# EAGLE design HighPowerLed_SMD (EAGLE 5.00)
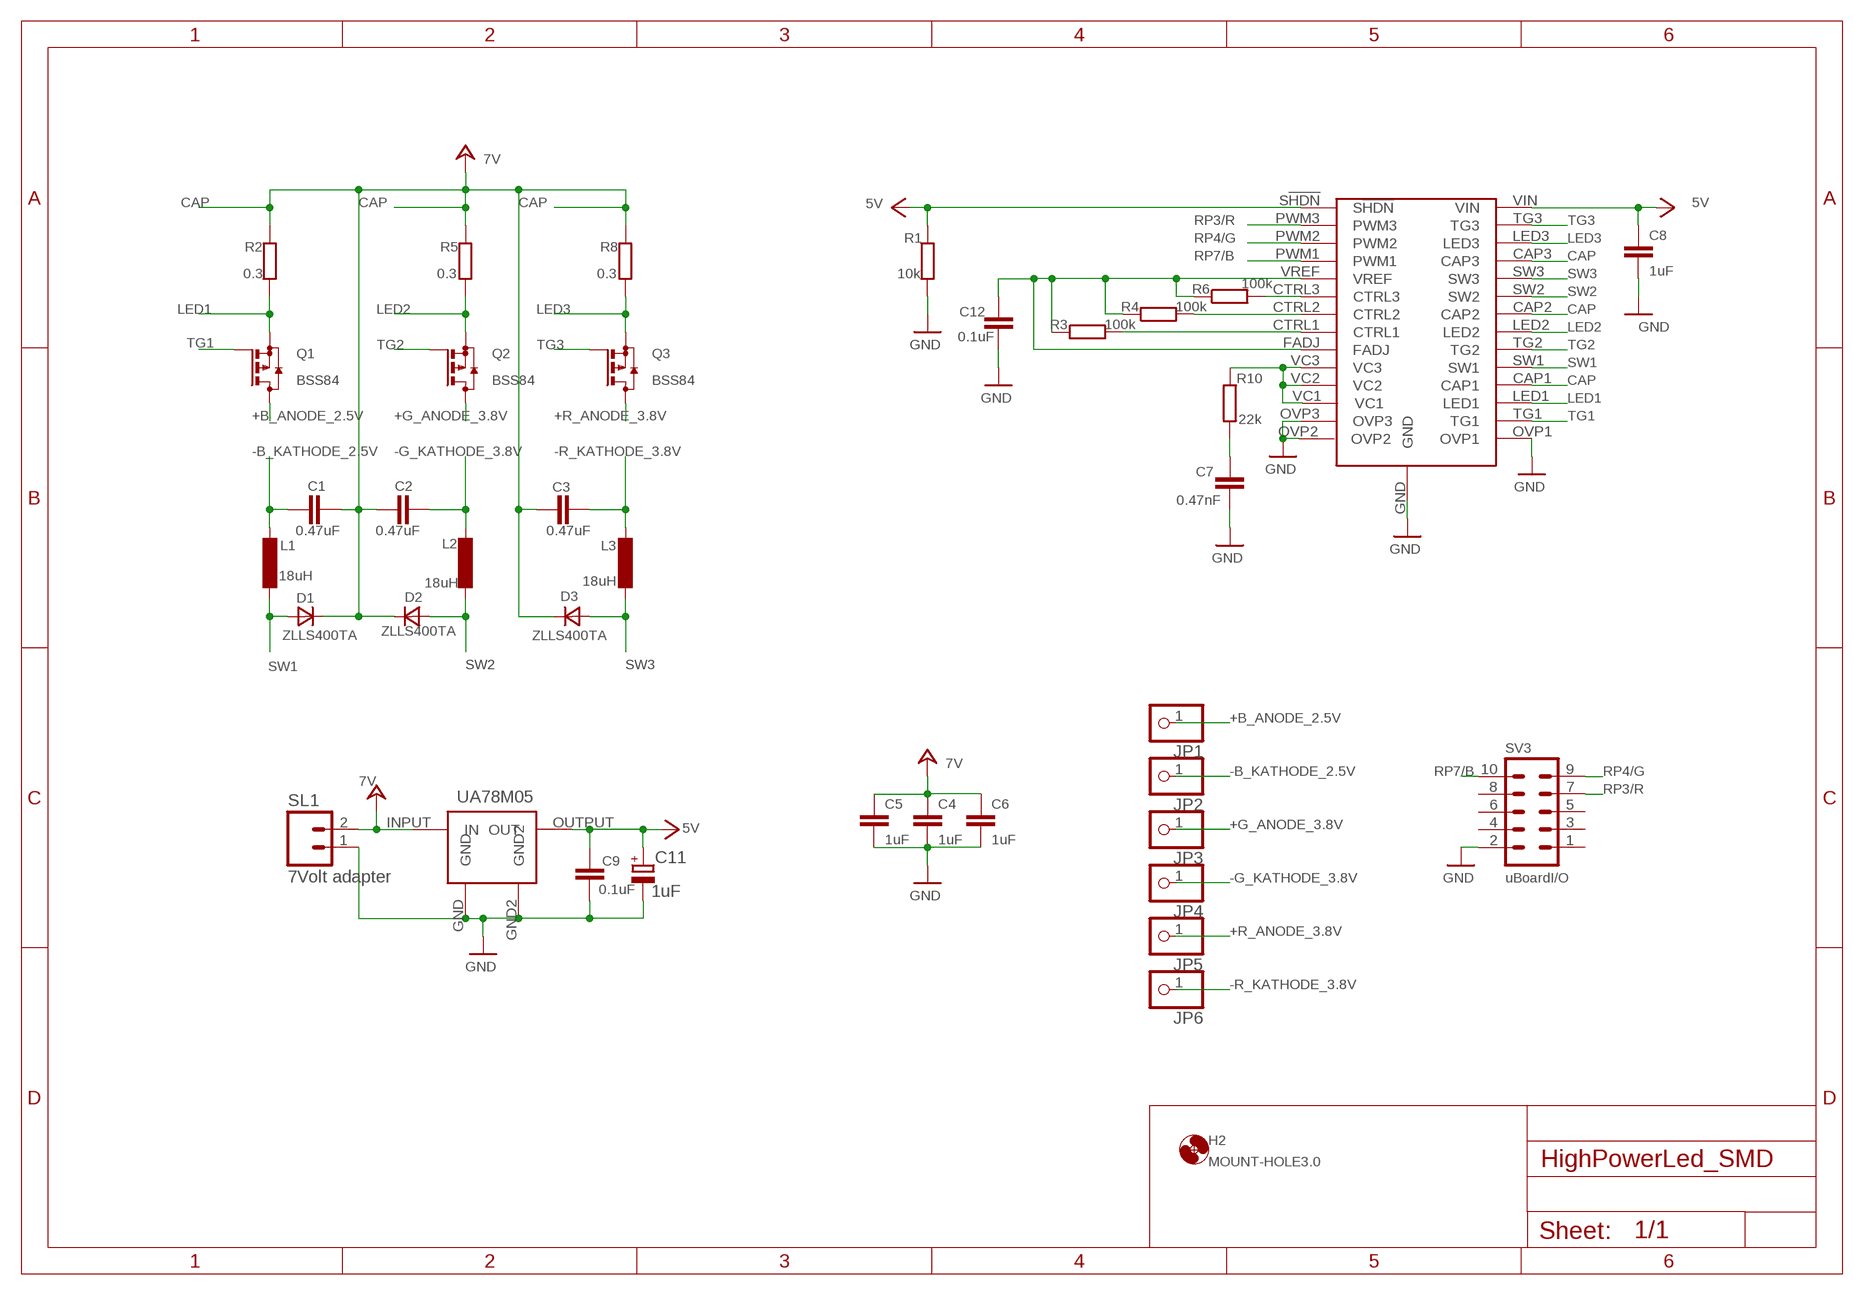
[diagram p0: schematic, sheet 1]

## Parts
C1  0.47uF  C-EUC1206K  [C1206K]
C2  0.47uF  C-EUC1206K  [C1206K]
C3  0.47uF  C-EUC1206K  [C1206K]
C4  1uF  C-EUC1206K  [C1206K]
C5  1uF  C-EUC1206K  [C1206K]
C6  1uF  C-EUC1206K  [C1206K]
C7  0.47nF  C-EUC1206K  [C1206K]
C8  1uF  C-EUC1206K  [C1206K]
C9  0.1uF  C-EUC1206K  [C1206K]
C11  1uF  CPOL-EU153CLV-0405  [153CLV-0405]
C12  0.1uF  C-EUC1206K  [C1206K]
D1  ZLLS400TA  DSOD323  [SOD323]
D2  ZLLS400TA  DSOD323  [SOD323]
D3  ZLLS400TA  DSOD323  [SOD323]
H2  MOUNT-HOLE3.0  [3,0]
IC1  GEERT  [ST7540]
JP1  PINHD-1X1  [1X01]
JP2  PINHD-1X1  [1X01]
JP3  PINHD-1X1  [1X01]
JP4  PINHD-1X1  [1X01]
JP5  PINHD-1X1  [1X01]
JP6  PINHD-1X1  [1X01]
L1  18uH  L-EUWE-TPC  [POWER-CHOKE_WE-TPC]
L2  18uH  L-EUWE-TPC  [POWER-CHOKE_WE-TPC]
L3  18uH  L-EUWE-TPC  [POWER-CHOKE_WE-TPC]
Q1  BSS84  [SOT23]
Q2  BSS84  [SOT23]
Q3  BSS84  [SOT23]
R1  10k  R-EU_R0805  [R0805]
R2  0.3  R-EU_R2512  [R2512]
R3  100k  R-EU_R0805  [R0805]
R4  100k  R-EU_R0805  [R0805]
R5  0.3  R-EU_R2512  [R2512]
R6  100k  R-EU_R0805  [R0805]
R8  0.3  R-EU_R2512  [R2512]
R10  22k  R-EU_R0805  [R0805]
SL1  7Volt adapter  M02  [02P]
SV3  uBoardI/O  ML10  [ML10]
UA78M05  UA78M05  [SOT223]

## Nets
+3V3: C8.1 C9.1 C11.+ IC1.S!HDN IC1.VIN R1.1 UA78M05.OUTPUT(OUT) ; supply symbol labelled 5V
+B_ANODE_2.5V: JP1.1 Q1.3(D)
+G_ANODE_3.8V: JP3.1 Q2.3(D)
+R_ANODE_3.8V: JP5.1 Q3.3(D)
-B_KATHODE_2.5V: C1.1 JP2.1 L1.2
-G_KATHODE_3.8V: C2.2 JP4.1 L2.2
-R_KATHODE_3.8V: C3.2 JP6.1 L3.1
CAP: C1.2 C2.1 C3.1 C4.1 C5.1 C6.1 D1.1(C) D2.1(C) D3.1(C) IC1.CAP1 IC1.CAP2 IC1.CAP3 R2.1 R5.1 R8.1 SL1.2 UA78M05.INPUT(IN) ; supply symbol labelled 7V
GND: C4.2 C5.2 C6.2 C7.2 C8.2 C9.2 C11.- C12.2 IC1.GND IC1.OVP1 IC1.OVP2 IC1.OVP3 R1.2 SL1.1 SV3.2 UA78M05.GND UA78M05.GND2
LED1: IC1.LED1 Q1.2(S) R2.2
LED2: IC1.LED2 Q2.2(S) R5.2
LED3: IC1.LED3 Q3.2(S) R8.2
N$2: IC1.CTRL3 R6.2
N$3: C12.1 IC1.FADJ IC1.VREF R3.1 R4.1 R6.1
N$4: IC1.CTRL2 R4.2
N$5: IC1.CTRL1 R3.2
N$10: IC1.VC1 IC1.VC2 IC1.VC3 R10.1
N$11: C7.1 R10.2
RP3/R: IC1.PWM3 SV3.7
RP4/G: IC1.PWM2 SV3.9
RP7/B: IC1.PWM1 SV3.10
SW1: D1.2(A) IC1.SW1 L1.1
SW2: D2.2(A) IC1.SW2 L2.1
SW3: D3.2(A) IC1.SW3 L3.2
TG1: IC1.TG1 Q1.1(G)
TG2: IC1.TG2 Q2.1(G)
TG3: IC1.TG3 Q3.1(G)
Unconnected: SV3.1 SV3.3 SV3.4 SV3.5 SV3.6 SV3.8

## Notes on the sheet
- UA78M05

## Library data of the parts
C1-C9 C12 = rcl:C-EU: CAPACITOR, European symbol
C11 = rcl:CPOL-EU: POLARIZED CAPACITOR, European symbol
D1-D3 = zetex:D: DIODE
H2 = holes:MOUNT-HOLE: MOUNTING HOLE with drill center marker
IC1 = LT3496:GEERT
JP1-JP6 = pinhead:PINHD-1X1: PIN HEADER
L1-L3 = rcl:L-EU: INDUCTOR, European symbol
Q1-Q3 = transistor-small-signal:BSS84: P-CHANNEL MOS FET
R1-R6 R8 R10 = rcl:R-EU_: RESISTOR, European symbol
SL1 = con-amp-quick:M02: AMP QUICK CONNECTOR
SV3 = dsPIC:ML10: HARTING
UA78M05 = uA78M05-Sot223:UA78M05

## Board
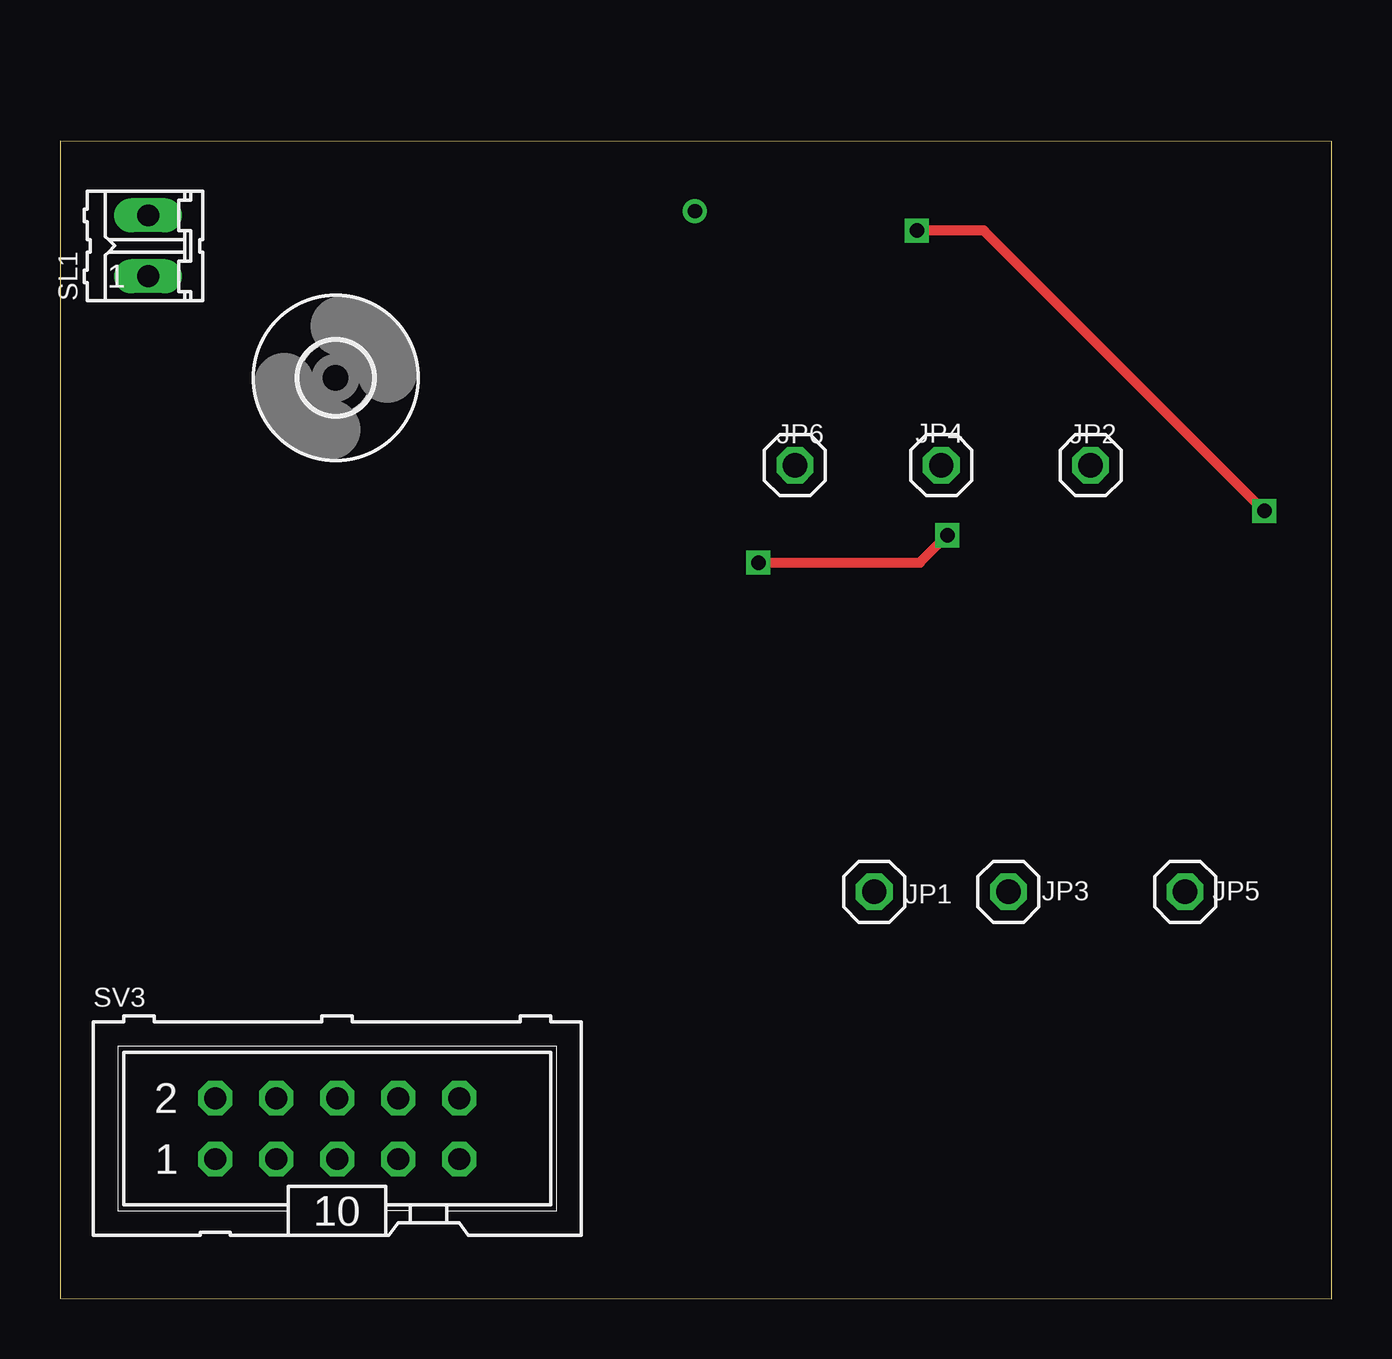
[diagram p1: board, top side]
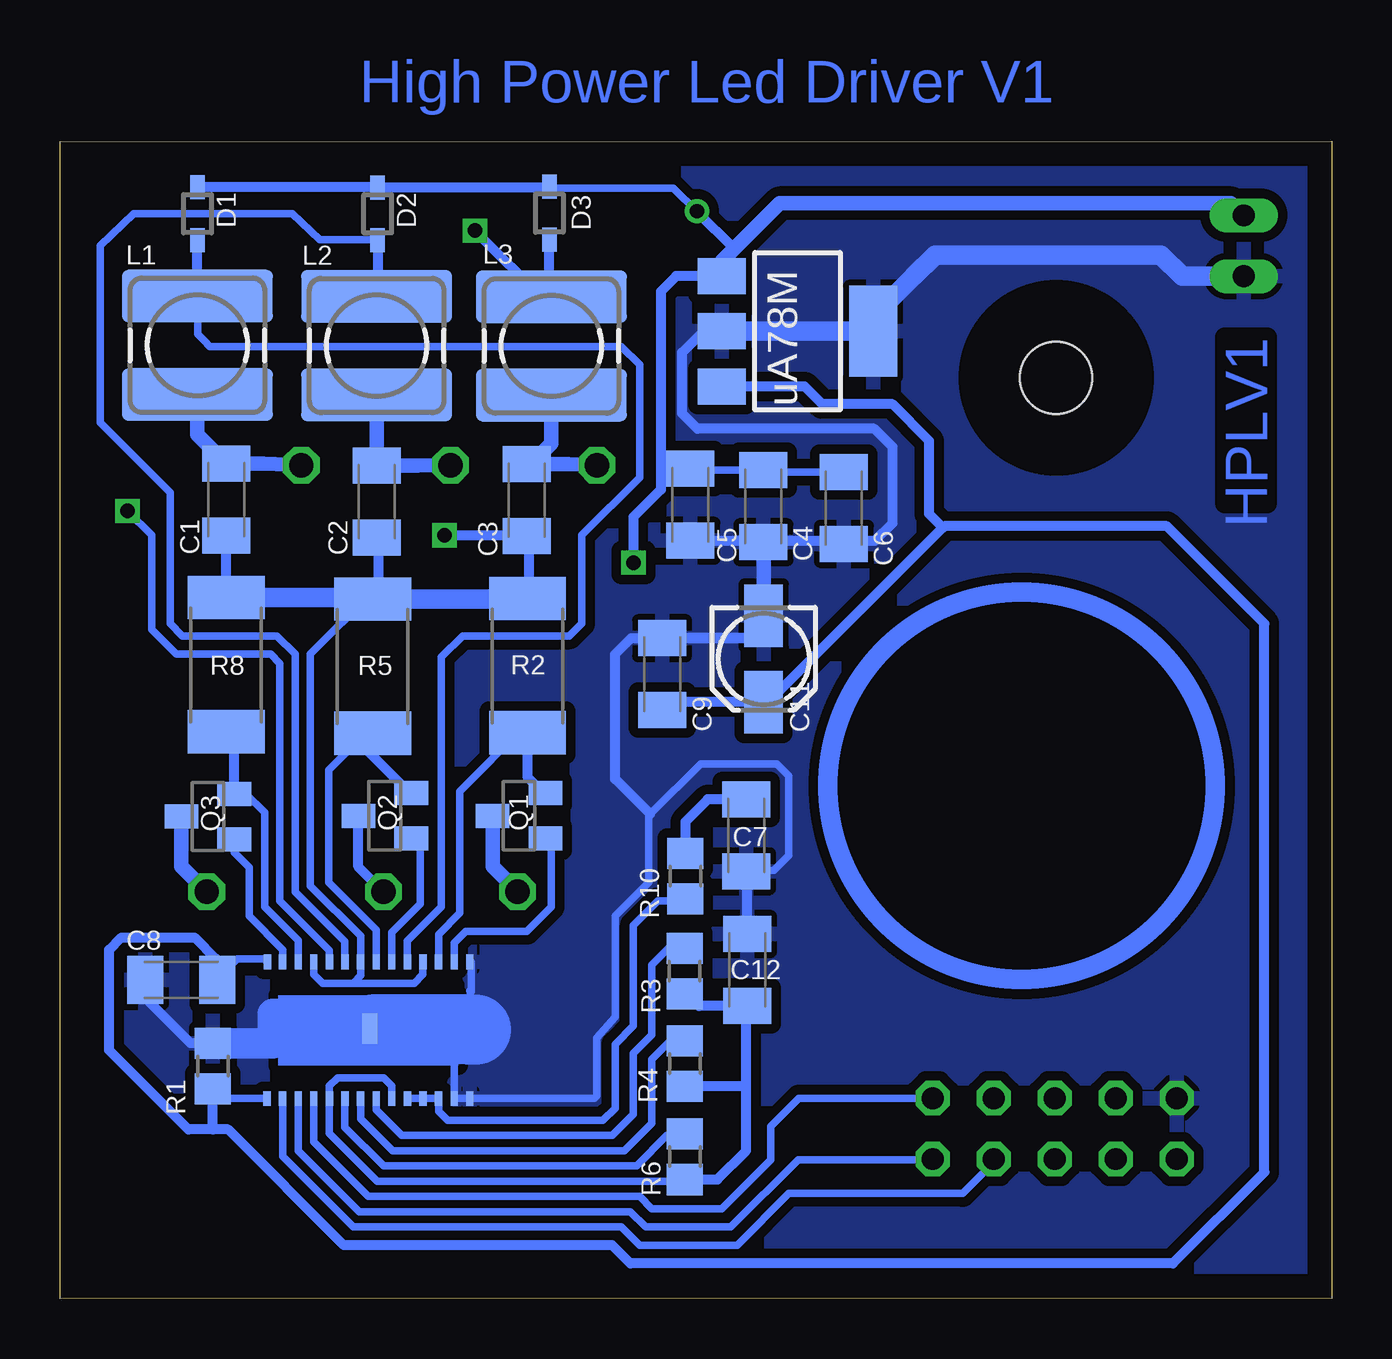
[diagram p2: board, bottom side, seen from below]

Size 52.99 x 48.24 mm. Coordinates in mm from the lower left corner, seen from the top.
Outline: 0,0.01 52.99,0 52.98,48.23 0.01,48.24 0,0.01
Copper layers (1*16): Top 0.035mm / dielectric 1.5mm / Bottom 0.035mm
Design rules "default *": minimum track width 10mil, minimum drill 24mil, track to track 16mil, track to pad 16mil, pad to pad 16mil, via to via 16mil, smd to smd 16mil, copper to edge 40mil, drill to drill 8mil, minimum pad ring 10mil, minimum via ring 8mil, stop-mask expansion 4mil, vias tented up to drill 0mil, thermal gap 10mil

### Footprints (pad centres in the part's own frame; a part is rotated, then mirrored left to right if it is on the bottom)
C1206K = smd 1.5 x 2: 1 -1.5,0; 2 1.5,0
153CLV-0405 = smd 2.6 x 1.6: + 1.8,0; - -1.8,0
SOD323 = smd 1 x 0.6: 1 -1.1,0; 2 1.1,0
3,0 = hole 3: 0,0
ST7540 = smd 0.61 x 0.305: CAP1 2.783,-2.219; CAP2 2.783,0.381; CAP3 2.783,2.331; CTRL1 -2.91,-0.269; CTRL2 -2.91,0.381; CTRL3 -2.91,1.031; FADJ -2.91,-0.919; LED1 2.783,-2.869; LED2 2.783,-0.269; LED3 2.783,2.981; OVP1 2.783,-4.169; OVP2 -2.91,-4.169; OVP3 -2.91,-3.519; PWM1 -2.91,2.331; PWM2 -2.91,2.981; PWM3 -2.91,3.631; S!HDN -2.91,4.281; SW1 2.783,-1.569; SW2 2.783,1.031; SW3 2.783,1.681; TG1 2.783,-3.519; TG2 2.783,-0.919; TG3 2.783,3.631; VC1 -2.91,-2.869; VC2 -2.91,-2.219; VC3 -2.91,-1.569; VIN 2.783,4.256; VREF -2.91,1.681 | smd 1.27 x 0.635: GND 0,0
1X01 = drill 1.016 octagon: 1 0,0
POWER-CHOKE_WE-TPC = smd 6.3 x 2.2: 1 0,2.05; 2 0,-2.05
SOT23 = smd 1 x 1.4: 1 -0.95,-1.1; 2 0.95,-1.1; 3 0,1.1
R0805 = smd 1.3 x 1.5: 1 -0.95,0; 2 0.95,0
R2512 = smd 1.8 x 3.2: 1 -2.8,0; 2 2.8,0
02P = drill 0.914 long: 1 -1.27,0; 2 1.27,0
ML10 = drill 0.914 octagon: 1 -5.08,-1.27; 2 -5.08,1.27; 3 -2.54,-1.27; 4 -2.54,1.27; 5 0,-1.27; 6 0,1.27; 7 2.54,-1.27; 8 2.54,1.27; 9 5.08,-1.27; 10 5.08,1.27
SOT223 = smd 3.8 x 2: GND 0,3.15 | smd 1.5 x 2: GND2 0,-3.15; INPUT -2.3,-3.15; OUTPUT 2.3,-3.15

### Placement (x,y rotation side)
C1  46.06,33.31 270 bottom
C2  39.79,33.22 90 bottom
C3  33.55,33.29 90 bottom
C4  23.69,33.03 270 bottom
C5  26.73,33.09 270 bottom
C6  20.33,32.96 270 bottom
C7  24.41,19.31 270 bottom
C8  47.95,13.28 180 bottom
C9  27.9,26.03 90 bottom
C11  23.68,26.67 270 bottom
C12  24.36,13.7 90 bottom
D1  47.27,45.22 270 bottom
D2  39.76,45.22 270 bottom
D3  32.6,45.25 270 bottom
H2  11.49,38.38 0 top
IC1  40.09,11.25 90 bottom
JP1  33.93,16.96 90 top
JP2  42.94,34.74 90 top
JP3  39.51,16.96 90 top
JP4  36.72,34.74 90 top
JP5  46.88,16.96 90 top
JP6  30.62,34.74 90 top
L1  47.27,39.74 0 bottom
L2  39.8,39.73 0 bottom
L3  32.52,39.71 180 bottom
Q1  33.87,20.13 90 bottom
Q2  39.46,20.13 90 bottom
Q3  46.83,20.1 90 bottom
R1  46.63,9.7 90 bottom
R2  33.52,26.39 270 bottom
R3  26.96,13.66 90 bottom
R4  26.96,9.8 90 bottom
R5  39.97,26.37 270 bottom
R6  26.96,5.92 90 bottom
R8  46.07,26.43 270 bottom
R10  26.94,17.61 90 bottom
SL1  3.67,43.88 90 top
SV3  11.55,7.09 0 top
UA78M05  22.27,40.32 270 bottom

### Tracks (layer width: path | path; a pad name or v marks a point on that pad's centre or on a via)
+3V3
  Bottom 0.305: R1.1 46.63,8.33 46.63,8.32 46.61,8.34 IC1.S!HDN 46.52,8.34 46.63,8.45 | IC1.VIN 44.34,14.17 45.61,14.17 46.49,13.28 | IC1.VIN | IC1.VIN 44.37,14.01 | 46.5,13.4 46.45,13.35 C8.1 46.49,13.28 | 46.49,13.28 46.5,13.28
  Bottom 0.406: 16.21,32.14 16.15,32.2 6.88,32.2 2.81,28.14 2.81,5.28 6.62,1.47 29.23,1.47 29.99,2.23 41.16,2.23 45.99,7.05 46.63,7.05 | 16.21,32.14 23.48,24.87 C11.+ 27.67,24.87 27.96,24.58 C9.1 | 46.5,13.4 46.5,14.17 47.39,15.06 50.44,15.06 50.94,14.55 50.94,10.36 47.64,7.05 46.63,7.05 | 46.63,7.05 46.63,8.45 | UA78M05.OUTPUT 21.97,38.02 21.23,37.28 18.3,37.28 16.78,35.76 16.78,32.71 16.21,32.14
  Bottom 0.61: 23.77,24.07 23.73,24.11 C11.+
+B_ANODE_2.5V
  Bottom 0.61: Q1.3 34.97,18.01 JP1.1
+G_ANODE_3.8V
  Bottom 0.406: Q2.3 40.56,18.01 JP3.1
+R_ANODE_3.8V
  Bottom 0.61: Q3.3 47.93,18.01 JP5.1
-B_KATHODE_2.5V
  Bottom 0.61: JP2.1 44.54,34.81 C1.1 47.27,36.02 L1.2
-G_KATHODE_3.8V
  Bottom 0.61: JP4.1 38.1,34.72 C2.2 39.79,37.77 | 39.79,37.77 39.8,37.76 L2.2 | 39.79,37.77 39.77,37.79
-R_KATHODE_3.8V
  Bottom 0.61: L3.1 32.52,35.64 33.42,34.74 33.47,34.79 C3.2 31.82,34.79 JP6.1
CAP  (via drill 0.6, 0.6 pad 0.25)
  Top 0.406: v29.1,30.68 35.83,30.68 v36.97,31.82
  Bottom 0.305: IC1.CAP3 42.42,13.52 42.05,13.15 41.16,13.15 | 41.16,13.15 40.78,13.15 40.47,13.47 IC1.CAP2 40.47,15.12 42.56,17.21 42.56,26.87 40.01,29.42 R5.1 39.97,28.95 | IC1.CAP1 37.87,13.53 38.24,13.15 41.16,13.15 | C6.1 23.74,34.46 23.77,34.49 23.72,34.53 C4.1 26.73,34.53 26.79,34.59 | 26.81,34.61 26.79,34.59 | 26.79,34.59 C5.1 | D3.1 32.58,46.35 32.53,46.3 27.45,46.3 26.45,45.3 | 26.43,45.28 26.45,45.3 | 26.45,45.3 v26.45,45.33
  Bottom 0.406: 33.45,29.44 33.45,31.86 33.55,31.95 33.55,31.94 C3.1 33.45,31.79 33.42,31.82 v36.97,31.82 | C2.1 39.79,31.8 39.77,31.82 39.72,31.77 39.72,29.23 | 46.06,32.01 45.99,32.07 | 46.06,32.01 C1.2 | R8.1 46.07,31.99 46.06,32.01 | D1.1 39.87,46.32 39.77,46.42 39.76,46.42 D2.1 32.63,46.32 D3.1 | D3.1 32.53,46.42 | D3.1 | 26.81,34.61 27.7,34.61 27.96,34.99 | 27.32,42.61 27.32,42.62 | 27.96,34.99 27.96,41.98 27.32,42.61 | 24.91,43.76 26.43,45.28 | UA78M05.INPUT 27.32,42.61 | 27.96,34.99 27.96,33.72 29.1,32.58 v29.1,30.68
  Bottom 0.61: 26.05,42.61 26.06,42.62 UA78M05.INPUT 25.42,43.25 24.91,43.76 23,45.66 4.21,45.66 3.7,45.15 SL1.2
  Bottom 0.813: 39.66,29.42 39.64,29.41 | 39.66,29.42 R5.1 33.43,29.17 | R8.1 39.72,29.23 39.66,29.42 | 33.43,29.17 33.45,29.44 R2.1 | 33.43,29.17 33.42,29.41
GND
  Bottom 0.305: 36.48,8.34 36.47,8.32 36.45,8.34 35.98,8.34 | 36.48,8.34 IC1.OVP3 36.57,11.22 | 35.98,8.34 IC1.OVP2 | C5.2 23.54,31.59 23.51,31.57 23.55,31.53 C4.2 20.3,31.53 20.23,31.46 | 20.23,31.46 20.21,31.44 | 20.23,31.46 C6.2 | C11.- 23.72,27.71 23.77,27.76 23.99,27.53 | 35.98,8.34 36.48,8.34 | C7.2 24.49,17.81 24.53,17.85 23.26,17.85 22.62,18.49 22.62,21.79 23.13,22.3 26.31,22.3 28.4,20.2 28.46,20.14 28.46,17.34 29.86,15.94 29.86,11.75 30.62,10.87 30.62,8.45 30.73,8.34 35.98,8.34 | 35.92,12.83 35.91,12.83 35.91,12.79 | 35.91,12.79 35.91,12.13 35.96,12.13 35.96,11.22 | 35.91,12.79 35.86,12.79 35.86,14.04 IC1.OVP1
  Bottom 0.406: 23.72,27.71 23.59,27.71 23.51,27.63 23.61,27.53 | 23.61,27.53 C9.2 | C7.2 24.41,17.85 24.4,17.85 24.36,17.81 C12.2 | R1.2 47.55,10.65 49.55,12.64 49.55,13.15 49.42,13.28 49.43,13.28 C8.2 | 23.61,27.53 29.2,27.53 29.86,26.87 29.86,21.66 28.4,20.2 | 40.41,10.62 40.4,10.61 | IC1.GND 40.41,10.62 | 40.41,10.62 40.44,10.65 | C5.2 19.04,31.59 18.3,32.33 18.3,35.5 19.07,36.27 26.43,36.27 27.07,36.9 27.07,39.44 26.05,40.46 25.54,40.46 UA78M05.GND2
  Bottom 0.61: 23.67,31.53 23.64,31.57 | 23.67,31.53 C4.2 | C11.- 23.68,31.53 23.67,31.53 | 17.41,42.61 17.42,42.61
  Bottom 0.813: 17.41,42.61 18.43,41.6 19.71,40.32 | 19.71,40.32 UA78M05.GND | UA78M05.GND2 19.71,40.32 | SL1.1 6.24,42.61 7.13,43.5 16.53,43.5 17.42,42.61
  Bottom 1.27: IC1.GND 40.05,11.25 40.02,11.22 40.6,10.65 | R1.2 44.14,10.65 44.14,11.88 40.38,11.88 40.38,10.61 40.4,10.61
  Bottom 2.921: 35.65,11.22 35.96,11.22 40.02,11.22
  pour Bottom: -0.72,48.69 53.59,48.94 53.76,-0.76 -0.7,-0.48
LED1
  Bottom 0.305: IC1.LED1 37.22,15.19 36.34,16.07 36.34,21.15 33.65,23.84 R2.2
  Bottom 0.406: Q1.2 32.77,21.04 32.78,21.03 33.52,21.76 R2.2
LED2
  Bottom 0.305: 40.02,23.82 40.28,23.57 | 39.9,23.95 39.97,23.87 R5.2 40.02,23.82 | IC1.LED2 39.82,15.36 41.8,17.34 41.8,22.04 40.02,23.82
  Bottom 0.406: Q2.2 38.42,21.08 40.28,22.93 40.28,23.57
LED3
  Bottom 0.305: IC1.LED3 43.07,14.93 44.47,16.33 44.47,20.26 45.25,21.05 Q3.2
  Bottom 0.406: R8.2 46.06,23.89 45.73,23.56 Q3.2
N$2
  Bottom 0.305: IC1.CTRL3 41.12,7.14 39.51,5.53 28.97,5.53 27.7,6.8 27.07,6.8 26.96,6.91 | 26.96,6.91 26.94,6.93 | R6.2 26.96,6.91
N$3
  Bottom 0.305: IC1.FADJ 39.17,8.87 39.51,9.21 41.42,9.21 41.77,8.86 IC1.VREF 41.77,6.9 39.77,4.9 26.94,4.9 26.96,4.91 R6.1
  Bottom 0.406: R3.1 26.96,12.75 26.94,12.77 26.38,12.2 C12.1 24.36,12.18 24.4,12.13 24.4,8.83 | R6.1 25.6,4.97 24.4,6.17 24.4,8.83 | R4.1 24.42,8.85 24.4,8.83
N$4
  Bottom 0.305: IC1.CTRL2 40.47,7.5 39.13,6.17 29.48,6.17 28.34,7.31 28.34,9.98 27.58,10.74 26.94,10.74 R4.2
N$5
  Bottom 0.305: R3.2 27.64,14.61 28.34,13.91 28.34,10.99 29.1,10.23 29.1,7.69 29.99,6.8 38.75,6.8 39.82,7.87 IC1.CTRL1
N$10
  Bottom 0.305: IC1.VC3 38.5,8.32 38.48,8.34 IC1.VC2 37.87,8.33 37.86,8.32 37.84,8.34 IC1.VC1 37.22,7.81 36.85,7.44 30.37,7.44 29.86,7.94 29.86,10.61 29.1,11.37 29.1,15.56 28.08,16.58 26.94,16.58 26.86,16.66 | 26.86,16.66 26.81,16.71 | 26.86,16.66 R10.1
N$11
  Bottom 0.406: C7.1 26.01,20.81 26.94,19.88 26.94,18.49 R10.2
RP3/R
  Bottom 0.305: IC1.PWM3 43.72,5.93 40.78,2.99 29.61,2.99 28.85,2.23 24.78,2.23 22.62,4.39 15.38,4.39 13.99,5.78 14.02,5.82 SV3.7
RP4/G
  Bottom 0.305: IC1.PWM2 43.07,6.17 40.53,3.63 29.23,3.63 28.59,2.99 25.04,2.99 22.24,5.78 16.53,5.78 16.56,5.82 SV3.9
RP7/B
  Bottom 0.305: IC1.PWM1 42.42,6.53 40.15,4.26 28.85,4.26 28.34,3.75 25.42,3.75 23.39,5.78 23.39,7.18 22.21,8.36 SV3.10
SW1
  Bottom 0.305: 47.01,39.95 47.26,40.2 47.26,41.6 47.27,41.61 L1.1 | 47.01,39.95 46.88,39.82 | IC1.SW1 38.52,14.91 37.1,16.33 37.1,26.74 36.21,27.63 31.77,27.63 31.26,28.14 31.26,31.82 28.85,34.23 28.85,38.93 29.61,39.69 46.75,39.69 47.01,39.95
  Bottom 0.406: L1.1 47.27,41.84 47.26,41.85 47.27,41.86 D1.2
SW2
  Bottom 0.305: IC1.SW2 41.12,14.88 43.2,16.96 43.2,26.87 43.96,27.63 47.9,27.63 48.4,28.14 48.4,33.6 51.33,36.52 51.33,43.88 49.93,45.23 43.32,45.23 42.18,44.14 39.77,44.14 D2.2
  Bottom 0.406: 39.84,41.78 39.9,41.73 | 39.84,41.78 L2.1 | D2.2 39.76,41.86 39.84,41.78
SW3  (via drill 0.6)
  Top 0.406: v50.18,32.84 38.5,44.52 v35.7,44.52
  Bottom 0.305: IC1.SW3 41.77,14.52 43.83,16.58 43.83,26.49 44.21,26.87 48.15,26.87 49.17,27.88 49.17,31.82 v50.18,32.84
  Bottom 0.406: 32.6,44.19 D3.2 | 32.6,41.93 32.6,44.19 | 32.6,44.19 32.53,44.27 | 33.33,41.76 L3.2 32.62,41.76 32.78,41.6 v35.7,44.52
  Bottom 0.61: L3.2 32.52,41.85 32.6,41.93
TG1
  Bottom 0.305: IC1.TG1 36.57,14.83 36.09,15.31 33.55,15.31 32.53,16.33 32.53,18.87 32.78,19.12 32.77,19.13 Q1.1
TG2
  Bottom 0.305: IC1.TG2 39.17,15.27 37.99,16.45 37.99,18.74 38.37,19.12 38.36,19.13 Q2.1
TG3
  Bottom 0.305: Q3.1 45.73,18.61 45.1,17.98 45.1,15.94 43.7,14.55 43.7,13.91 43.72,13.93 IC1.TG3
(copper drawn outside any net)
  shapes: Bottom circle x1

### Text on the board
Bottom: High Power Led Driver V1 | HPLV1